# Altium schematic sheet PIC32ETH_Peripheral.SchDoc: Peripheral
size A4; SheetNumber: 5
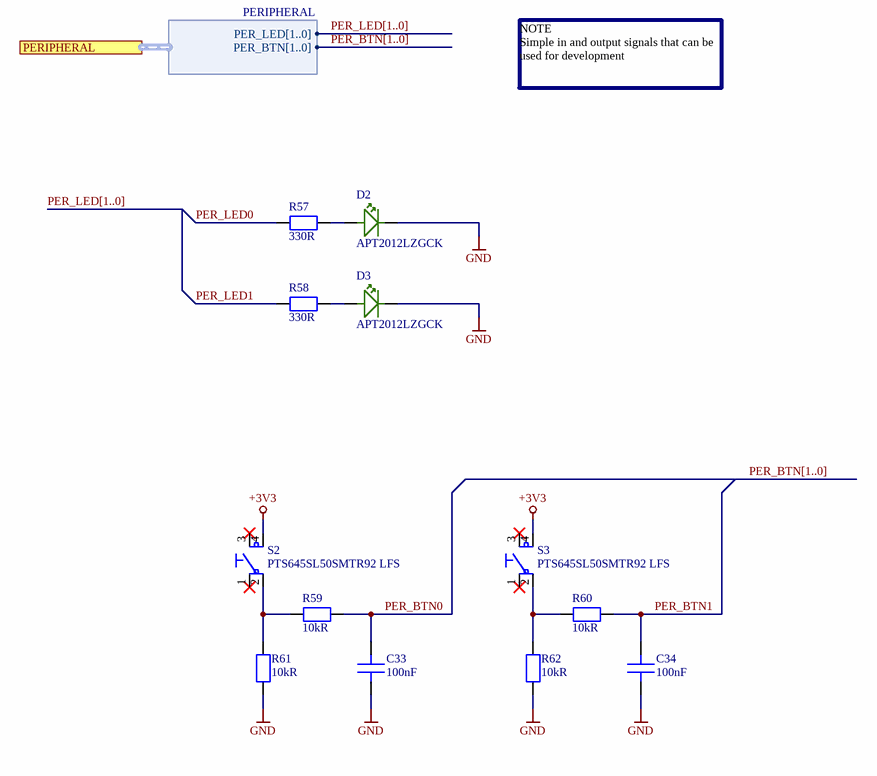
[diagram p0: PIC32ETH_Peripheral.SchDoc]

## Parts
C33  100nF  [C_CHIP2012N]
C34  100nF  [C_CHIP2012N]
D2  APT2012LZGCK  [D_LEDCHIP2012N]
D3  APT2012LZGCK  [D_LEDCHIP2012N]
R57  330R  [R_CHIP2012N]
R58  330R  [R_CHIP2012N]
R59  10kR  [R_CHIP2012N]
R60  10kR  [R_CHIP2012N]
R61  10kR  [R_CHIP2012N]
R62  10kR  [R_CHIP2012N]
S2  PTS645SL50SMTR92 LFS  [S_CHIPP620X620-4N]
S3  PTS645SL50SMTR92 LFS  [S_CHIPP620X620-4N]

## Ports
PERIPHERAL (harness PERIPHERAL)

## Harnesses
PERIPHERAL: PER_BTN[1..0], PER_LED[1..0]

## Nets
+3V3: S2.4 S3.4
GND: C33.2 C34.2 D2.1 D3.1 R61.1 R62.1
PER_BTN0: C33.1 R59.1
PER_BTN1: C34.1 R60.1
PER_LED0: R57.1
PER_LED1: R58.1
NetD2_2: D2.2 R57.2
NetD3_2: D3.2 R58.2
NetR59_2: R59.2 R61.2 S2.2
NetR60_2: R60.2 R62.2 S3.2

Not connected (* = marked no-connect by the designer): S2 1* 3*; S3 1* 3*

## Buses and harness runs
bus PER_BTN[1..0]
bus PER_LED[1..0]

## Notes on the sheet
- NOTE
  Simple in and output signals that can be used for development
- Project:
- Doc Nr:
- File:
- Drawn:
- Rev:
- Date:
- Size:
- Sheet:
- A4
- of

## Library data of the parts
C33 C34 = C_C0805C104K5RACTU: C CERAMIC 100nF 50V 10% 2012; Manufacturer: Kemet; Dielectric: X7R; Tolerance: +/-10%; Datasheet Url: https://content.kemet.com/datasheets/KEM_C1002_X7R_SMD.pdf; Mounting: SMT; Package: 2012; Part Number: C0805C104K5RACTU; Price: 0.23; Price Currency: CHF; Supplier 1: Digi-Key; Capacitance: 100nF; Voltage: 50V; Supplier Part Number 1: 399-1170-1-ND; Esr: n/a; Pin Count: 2; Temperature Range: -55degC to 125degC
D2 D3 = D_APT2012LZGCK: D LED GREEN CLEAR 2.65V 2mA 2012; Manufacturer: Kingbright; Voltage Reverse: 5V; Current Reverse: 50uA; Power: 102.5mW; Datasheet URL: http://www.kingbrightusa.com/images/catalog/SPEC/APT2012LZGCK.pdf; Mounting: SMT; Package: 2012; Part Number: APT2012LZGCK; Price: 0.55; Price Currency: CHF; Supplier 1: Digi-Key; Supplier Part Number 1: 754-1939-1-ND; Temperature Range: -40degC to 85degC; Pin Count: 2; Current Forward: 2mA; Voltage Forward: 2.65V; Color: Green; Lens Transparency: Clear
R57 R58 = R_RMCF0805FT330R: R SMT 330R 1% 125mW 2012; Manufacturer: Stackpole Electronics Inc; Temperature Coefficient: 100ppm/degC; Tolerance: +/-1%; Voltage: 150V; Datasheet Url: https://www.seielect.com/catalog/sei-rmcf_rmcp.pdf; Mounting: SMT; Package: 2012; Part Number: RMCF0805FT330R; Price: 0.10; Price Currency: CHF; Supplier 1: Digi-Key; Resistance: 330R; Supplier Part Number 1: RMCF0805FT330RCT-ND; Temperature Range: -55degC to 155degC; Pin Count: 2; Power: 125mW
R59-R62 = R_RMCF0805FT10K0: R SMT 10kR 1% 125mW 2012; Manufacturer: Stackpole Electronics Inc; Temperature Coefficient: 100ppm/degC; Tolerance: +/-1%; Voltage: 150V; Datasheet Url: https://www.seielect.com/catalog/sei-rmcf_rmcp.pdf; Mounting: SMT; Package: 2012; Part Number: RMCF0805FT10K0; Price: 0.10; Price Currency: CHF; Supplier 1: Digi-Key; Resistance: 10kR; Power: 125mW; Supplier Part Number 1: RMCF0805FT10K0CT-ND; Pin Count: 2; Temperature Range: -55degC to 155degC
S2 S3 = S_PTS645SL50SMTR92LFS: S TACTILE SPST-NO 12V 50mA SMT; Manufacturer: C&K; Cycles Mechanical: 100000; Datasheet Url: https://dznh3ojzb2azq.cloudfront.net/products/Tactile/PTS645/documents/datasheet.pdf; Mounting: SMT; Package: n/a; Part Number: PTS645SL50SMTR92 LFS; Price: 0.30; Price Currency: CHF; Supplier 1: Digi-Key; Pin Count: 4; Temperature Range: -20degC to 60degC; Supplier Part Number 1: CKN9088CT-ND; Current: 50mA; Cycles Electrical: n/a; Voltage: 12V; Switch Type: SPST-NO